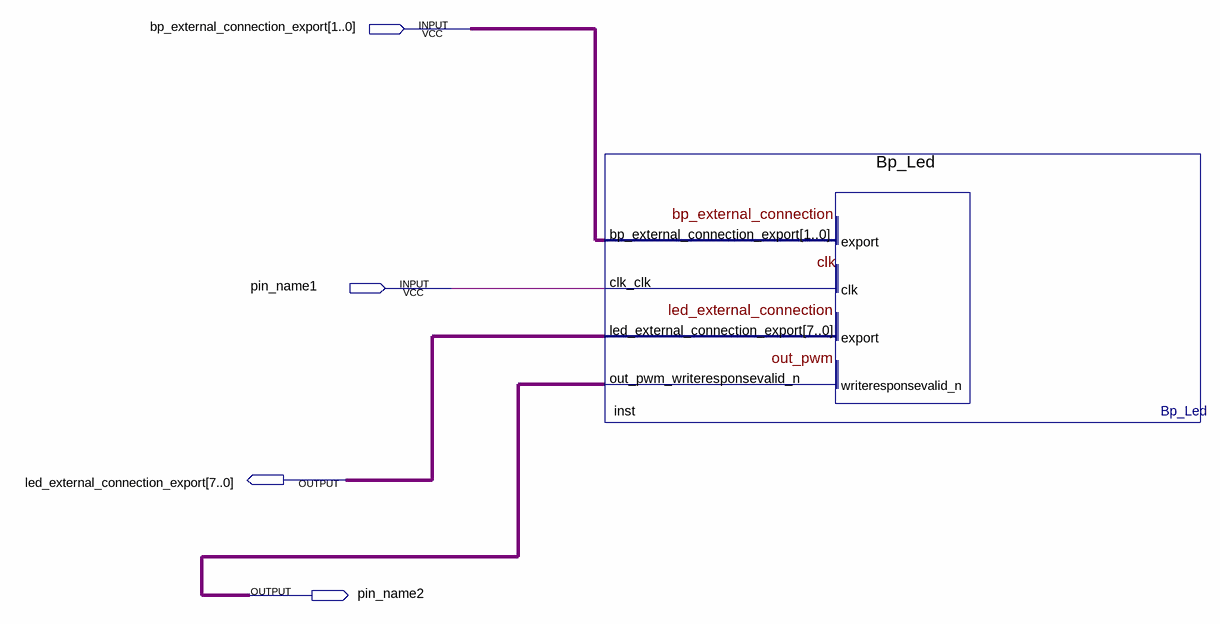
[diagram p0: schematic sheet]
// Quartus schematic LED.bdf as structural Verilog: 1 symbols, 4 pins
module LED (
  input  [1:0] bp_external_connection_export,
  input  pin_name1,
  output [7:0] led_external_connection_export,
  output pin_name2
);

  Bp_Led inst (
    .bp_external_connection_export(bp_external_connection_export), .clk_clk(pin_name1),
    .led_external_connection_export(led_external_connection_export), .out_pwm_writeresponsevalid_n(pin_name2));
endmodule
